# Altium schematic sheet Edge_Slot_Interface.SchDoc
size A4
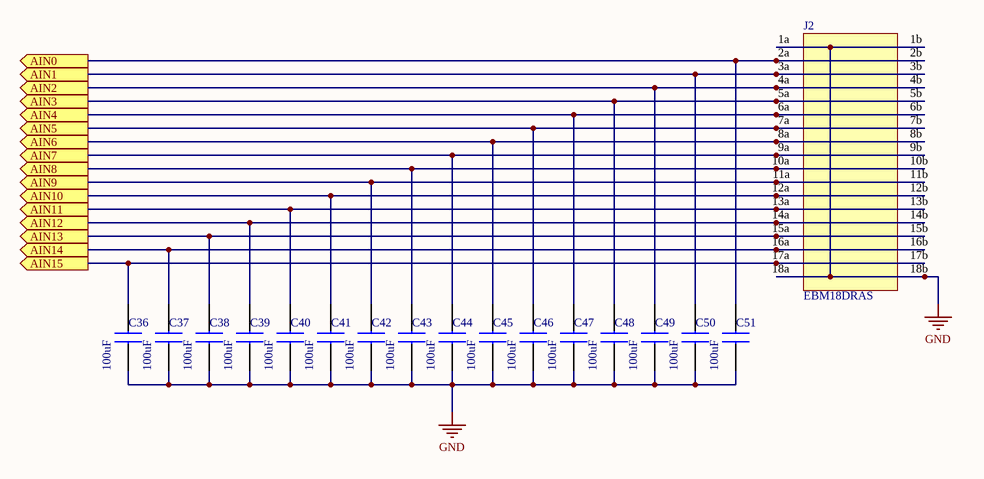
[diagram p0: Edge_Slot_Interface.SchDoc]

## Parts
C36  100uF  [Cap_0805]
C37  100uF  [Cap_0805]
C38  100uF  [Cap_0805]
C39  100uF  [Cap_0805]
C40  100uF  [Cap_0805]
C41  100uF  [Cap_0805]
C42  100uF  [Cap_0805]
C43  100uF  [Cap_0805]
C44  100uF  [Cap_0805]
C45  100uF  [Cap_0805]
C46  100uF  [Cap_0805]
C47  100uF  [Cap_0805]
C48  100uF  [Cap_0805]
C49  100uF  [Cap_0805]
C50  100uF  [Cap_0805]
C51  100uF  [Cap_0805]
J2  EBM18DRAS  [EBM18DRAS]

## Ports
AIN0 (out), AIN1 (out), AIN2 (out), AIN3 (out), AIN4 (out), AIN5 (out), AIN6 (out), AIN7 (out), AIN8 (out), AIN9 (out), AIN10 (out), AIN11 (out), AIN12 (out), AIN13 (out), AIN14 (out), AIN15 (out)

## Nets
GND: C36.1 C37.1 C38.1 C39.1 C40.1 C41.1 C42.1 C43.1 C44.1 C45.1 C46.1 C47.1 C48.1 C49.1 C50.1 C51.1 J2.1a J2.1b J2.18a J2.18b
AIN0: C51.2 J2.2a J2.2b ; port AIN0
AIN1: C50.2 J2.3a J2.3b ; port AIN1
AIN2: C49.2 J2.4a J2.4b ; port AIN2
AIN3: C48.2 J2.5a J2.5b ; port AIN3
AIN4: C47.2 J2.6a J2.6b ; port AIN4
AIN5: C46.2 J2.7a J2.7b ; port AIN5
AIN6: C45.2 J2.8a J2.8b ; port AIN6
AIN7: C44.2 J2.9a J2.9b ; port AIN7
AIN8: C43.2 J2.10a J2.10b ; port AIN8
AIN9: C42.2 J2.11a J2.11b ; port AIN9
AIN10: C41.2 J2.12a J2.12b ; port AIN10
AIN11: C40.2 J2.13a J2.13b ; port AIN11
AIN12: C39.2 J2.14a J2.14b ; port AIN12
AIN13: C38.2 J2.15a J2.15b ; port AIN13
AIN14: C37.2 J2.16a J2.16b ; port AIN14
AIN15: C36.2 J2.17a J2.17b ; port AIN15

## Library data of the parts
C36-C51 = VJ1206G106KXXTW1BC: Multilayer Ceramic Capacitors MLCC - SMD/SMT 10uF 25volts 10%; Manufacturer_Name: Vishay; Geometry.Height: 1.7mm; Manufacturer_Part_Number: VJ1206G106KXXTW1BC; Arrow Part Number: VJ1206G106KXXTW1BC; Arrow Price/Stock: *; Mouser Part Number: 77-VJ126G106KXXTW1BC; Mouser Price/Stock: https://www.mouser.co.uk/ProductDetail/Vishay-Vitramon/VJ1206G106KXXTW1BC?qs=%252BqhDFMvZazSFJ5Hhl5VYQw%3D%3D; Datasheet Link: http://www.vishay.com/docs/45200/vjhirelseries.pdf
J2 = EBM18DRAS: CONN EDGE DUAL FMALE 18POS 0.051mm dia